# Altium schematic sheet Top.SchDoc
size A
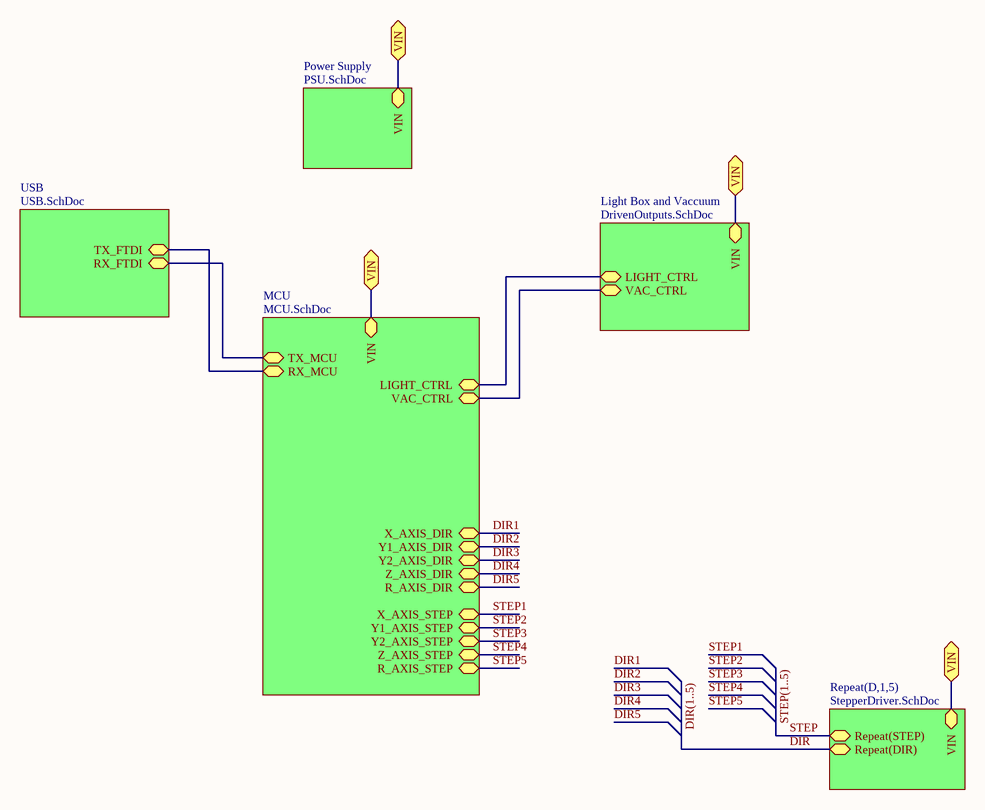
[diagram p0: Top.SchDoc]

## Sub-sheets
Light Box and Vaccuum = DrivenOutputs.SchDoc: LIGHT_CTRL, VAC_CTRL, VIN
MCU = MCU.SchDoc: VAC_CTRL, TX_MCU, RX_MCU, X_AXIS_STEP, Y2_AXIS_STEP, X_AXIS_DIR, Y2_AXIS_DIR, Z_AXIS_DIR, Y1_AXIS_DIR, Y1_AXIS_STEP, LIGHT_CTRL, VIN, R_AXIS_DIR, Z_AXIS_STEP, R_AXIS_STEP
Power Supply = PSU.SchDoc: VIN
Repeat(D,1,5) = StepperDriver.SchDoc: Repeat(STEP), Repeat(DIR), VIN
USB = USB.SchDoc: TX_FTDI, RX_FTDI

## Ports
VIN

## Nets
DIR: sheet Repeat(D,1,5)/Repeat(DIR)
DIR1: sheet MCU/X_AXIS_DIR
DIR2: sheet MCU/Y1_AXIS_DIR
DIR3: sheet MCU/Y2_AXIS_DIR
DIR4: sheet MCU/Z_AXIS_DIR
DIR5: sheet MCU/R_AXIS_DIR
STEP: sheet Repeat(D,1,5)/Repeat(STEP)
STEP1: sheet MCU/X_AXIS_STEP
STEP2: sheet MCU/Y1_AXIS_STEP
STEP3: sheet MCU/Y2_AXIS_STEP
STEP4: sheet MCU/Z_AXIS_STEP
STEP5: sheet MCU/R_AXIS_STEP
VIN: port VIN, sheet MCU/VIN, sheet Light Box and Vaccuum/VIN, sheet Repeat(D,1,5)/VIN, sheet Power Supply/VIN
(unnamed): sheet MCU/VAC_CTRL, sheet Light Box and Vaccuum/VAC_CTRL
(unnamed): sheet MCU/TX_MCU, sheet USB/RX_FTDI
(unnamed): sheet MCU/RX_MCU, sheet USB/TX_FTDI
(unnamed): sheet MCU/LIGHT_CTRL, sheet Light Box and Vaccuum/LIGHT_CTRL

## Buses and harness runs
bus DIR(1..5)
bus STEP(1..5)